# EAGLE design scanner-ale (EAGLE 6.6.0)
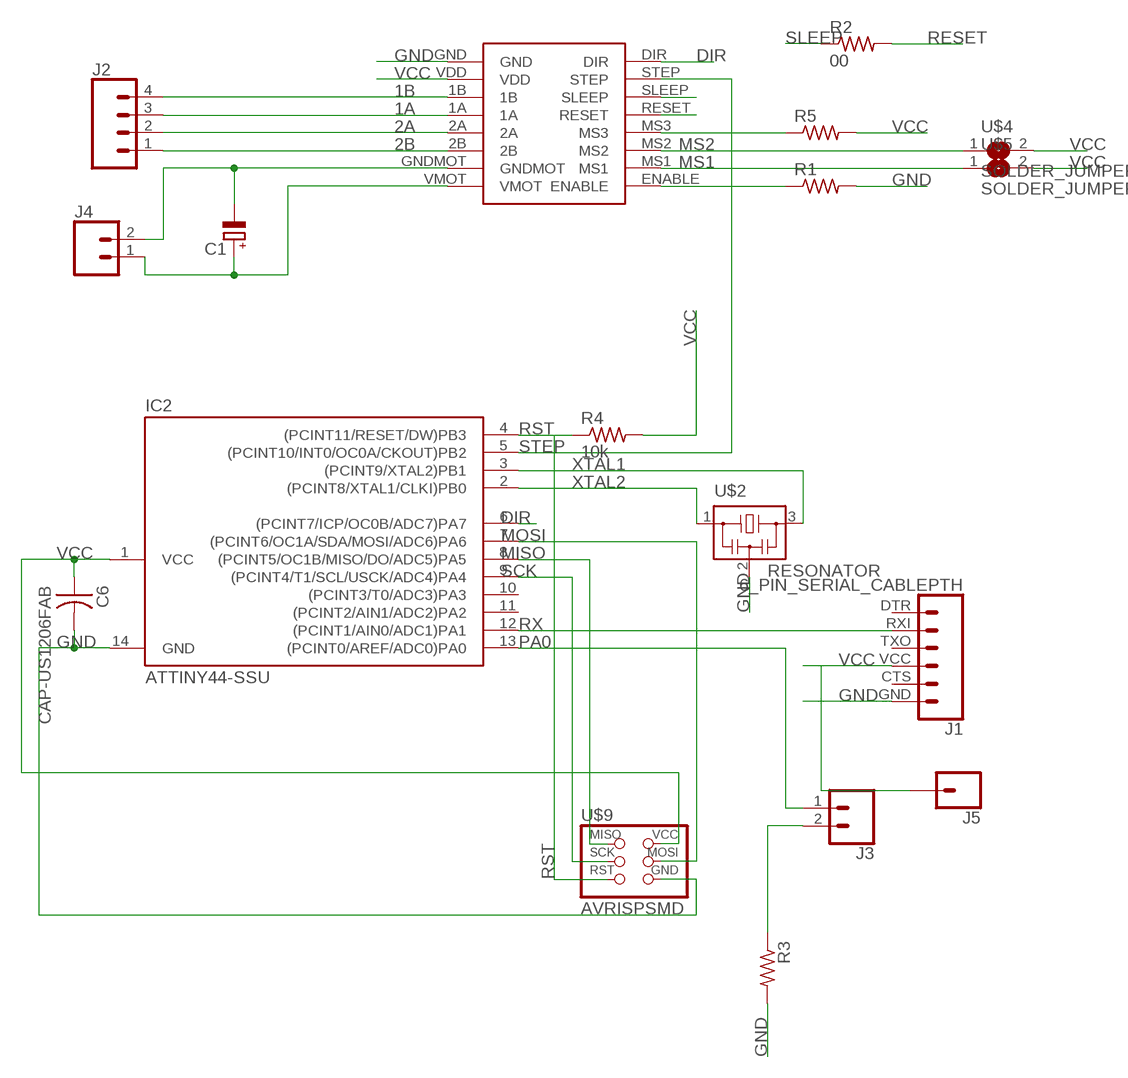
[diagram p0: schematic, sheet 1]

## Parts
C1  CPOL-EUE2,5-6E  [E2,5-6E]
C6  CAP-US1206FAB  [C1206FAB]
IC2  ATTINY44-SSU  [SOIC14]
J1  6_PIN_SERIAL_CABLEPTH  [FTDI_BASIC]
J2  CONN_04  [1X04]
J3  CONN_02  [1X02]
J4  CONN_02  [1X02]
J5  CONN_01  [1X01]
R1  RES-US1206FAB  [R1206FAB]
R2  00  RES-US1206FAB  [R1206FAB]
R3  RES-US1206FAB  [R1206FAB]
R4  10k  RES-US1206FAB  [R1206FAB]
R5  RES-US1206FAB  [R1206FAB]
U$1  POLOLUESTEPPERDRIVERDIL16MAT  [DIL16]
U$2  RESONATOR  [EFOBM]
U$4  SOLDER_JUMPER  [SJFAB]
U$5  SOLDER_JUMPER  [SJFAB]
U$9  AVRISPSMD  [2X03SMD]

## Nets
1A: J2.3 U$1.1A
1B: J2.4 U$1.1B
2A: J2.2 U$1.2A
2B: J2.1 U$1.2B
DIR: IC2.6((PCINT7/ICP/OC0B/ADC7)PA7) U$1.DIR
GND: C6.2 IC2.14(GND) J1.GND R1.2 R3.2 U$1.GND U$2.2 U$9.6(GND)
MISO: IC2.8((PCINT5/OC1B/MISO/DO/ADC5)PA5) U$9.1(MISO)
MOSI: IC2.7((PCINT6/OC1A/SDA/MOSI/ADC6)PA6) U$9.4(MOSI)
MS1: U$1.MS1 U$5.1
MS2: U$1.MS2 U$4.1
N$1: C1.- J4.2 U$1.GNDMOT
N$2: R1.1 U$1.ENABLE
N$3: C1.+ J4.1 U$1.VMOT
N$4: J3.2 R3.1
N$5: R5.1 U$1.MS3
PA0: IC2.13((PCINT0/AREF/ADC0)PA0) J3.1
RESET: R2.2 U$1.RESET
RST: IC2.4((PCINT11/RESET/DW)PB3) R4.1 U$9.5(RST)
RX: IC2.12((PCINT1/AIN0/ADC1)PA1) J1.RXI
SCK: IC2.9((PCINT4/T1/SCL/USCK/ADC4)PA4) U$9.3(SCK)
SLEEP: R2.1 U$1.SLEEP
STEP: IC2.5((PCINT10/INT0/OC0A/CKOUT)PB2) U$1.STEP
VCC: C6.1 IC2.1(VCC) J1.VCC J5.1 R4.2 R5.2 U$1.VDD U$4.2 U$5.2 U$9.2(VCC)
XTAL1: IC2.3((PCINT9/XTAL2)PB1) U$2.3
XTAL2: IC2.2((PCINT8/XTAL1/CLKI)PB0) U$2.1
Unconnected: IC2.10((PCINT3/T0/ADC3)PA3) IC2.11((PCINT2/AIN1/ADC2)PA2) J1.CTS J1.DTR J1.TXO

## Library data of the parts
C1 = rcl:CPOL-EU: POLARIZED CAPACITOR, European symbol
C6 = 01_fab:CAP-US
IC2 = 01_fab:ATTINY44
J1 = 01_SparkFun-Connectors:6_PIN_SERIAL_CABLE: 6-pin header connection for use with the "FTDI BASIC" pinout - CABLE SIDE. Also known as "Arduino Serial Program Header". This is used on a design to provide a 6-pin connection point for serial communication usually from a USB cable (D+/D-) to these headers (RX/TX). It also has the remaining pins necessary for programming in the Arduino evironment (DTR, GND, and sometimes VCC). Note, this device has "CABLE" in the name. It is intended to be used on a design that usually lives on the end of your USB cable and prvides the converter chip (FTDI232 or FTDI231x) to commnicate serial RX/TX. The "sister" device, named "TARGET" is inteneded to be used on a design that contains a target micro-controller that you wish to program. You can populate with some of these: Female Headers <https://www.sparkfun.com/products/115> (PRT-00115) For reference (or to suit your programming needs) check out these designs: SparkFun FTDI Basic Breakout - 5V <https://www.sparkfun.com/products/9716> (DEV-09716) SparkFun FTDI Basic Breakout - 3.3V <https://www.sparkfun.com/products/9873> (DEV-09873) SparkFun FTDI SmartBasic <https://www.sparkfun.com/products/12935> (DEV-12935) SparkFun Beefy 3 - FTDI Basic Breakout <https://www.sparkfun.com/products/13746> (DEV-13746)
J2 = 01_SparkFun-Connectors:CONN_04: Multi connection point. Often used as Generic Header-pin footprint for 0.1 inch spaced/style header connections On any of the 0.1 inch spaced packages, you can populate with these: Break Away Headers - Straight <https://www.sparkfun.com/products/116> (PRT-00116) Break Away Male Headers - Right Angle <https://www.sparkfun.com/products/553> (PRT-00553) Female Headers <https://www.sparkfun.com/products/115> (PRT-00115) Break Away Headers - Machine Pin <https://www.sparkfun.com/products/117> (PRT-00117) Break Away Female Headers - Swiss Machine Pin <https://www.sparkfun.com/products/743> (PRT-00743) For SCREWTERMINALS and SPRING TERMINALS visit here: Screw Terimnals on SparkFun.com <https://www.sparkfun.com/search/results?term=Screw+Terminals> (5mm/3.5mm/2.54mm spacing) This device is also useful as a general connection point to wire up your design to another part of your project. Our various solder wires solder well into these plated through hole pads. Hook-Up Wire - Assortment (Stranded, 22 AWG) <https://www.sparkfun.com/products/11375> (PRT-11375) Hook-Up Wire - Assortment (Solid Core, 22 AWG) <https://www.sparkfun.com/products/11367> (PRT-11367) View the entire wire category on our website here <https://www.sparkfun.com/categories/141> Special notes: Molex polarized connector foot print use with SKU : PRT-08231 with associated crimp pins and housings. 1MM SMD Version SKU: PRT-10208; PROD_ID: CONN-09696
J3 J4 = 01_SparkFun-Connectors:CONN_02: Multi connection point. Often used as Generic Header-pin footprint for 0.1 inch spaced/style header connections On any of the 0.1 inch spaced packages, you can populate with these: Break Away Headers - Straight <https://www.sparkfun.com/products/116> (PRT-00116) Break Away Male Headers - Right Angle <https://www.sparkfun.com/products/553> (PRT-00553) Female Headers <https://www.sparkfun.com/products/115> (PRT-00115) Break Away Headers - Machine Pin <https://www.sparkfun.com/products/117> (PRT-00117) Break Away Female Headers - Swiss Machine Pin <https://www.sparkfun.com/products/743> (PRT-00743) For SCREWTERMINALS and SPRING TERMINALS visit here: Screw Terimnals on SparkFun.com <https://www.sparkfun.com/search/results?term=Screw+Terminals> (5mm/3.5mm/2.54mm spacing) This device is also useful as a general connection point to wire up your design to another part of your project. Our various solder wires solder well into these plated through hole pads. Hook-Up Wire - Assortment (Stranded, 22 AWG) <https://www.sparkfun.com/products/11375> (PRT-11375) Hook-Up Wire - Assortment (Solid Core, 22 AWG) <https://www.sparkfun.com/products/11367> (PRT-11367) View the entire wire category on our website here <https://www.sparkfun.com/categories/141> Special notes: Molex polarized connector foot print use with: PRT-08233 with associated crimp pins and housings. 2.54_SCREWTERM for use with PRT-10571. 3.5mm Screw Terminal footprints for PRT-08084 5mm Screw Terminal footprints for use with PRT-08432
J5 = SparkFun-Connectors:CONN_01: Single connection point. Often used as Generic Header-pin footprint for 0.1 inch spaced/style header connections On any of the 0.1 inch spaced packages, you can populate with these: Break Away Headers - Straight <https://www.sparkfun.com/products/116> (PRT-00116) Break Away Male Headers - Right Angle <https://www.sparkfun.com/products/553> (PRT-00553) Female Headers <https://www.sparkfun.com/products/115> (PRT-00115) Break Away Headers - Machine Pin <https://www.sparkfun.com/products/117> (PRT-00117) Break Away Female Headers - Swiss Machine Pin <https://www.sparkfun.com/products/743> (PRT-00743) This device is also useful as a general connection point to wire up your design to another part of your project. Our various solder wires solder well into these plated through hole pads. Hook-Up Wire - Assortment (Stranded, 22 AWG) <https://www.sparkfun.com/products/11375> (PRT-11375) Hook-Up Wire - Assortment (Solid Core, 22 AWG) <https://www.sparkfun.com/products/11367> (PRT-11367) View the entire wire category on our website here <https://www.sparkfun.com/categories/141> Special notes: SMTSO-256-ET is a "flush mount" nut for a 4-40 screw. We mostly use this on specialty testbeds; it is a nice way to connect hardware to your PCB at an adjustable hieght. Also note, the SNAP packages are for using a snappable style connector. We sell a baggie of snaps and they are also used on two LilyPad designs: Snap Assortment - 30 pack (male and female) <https://www.sparkfun.com/products/11347> (DEV-11347) LilyPad Arduino SimpleSnap <https://www.sparkfun.com/products/10941> (DEV-10941) LilyPad SimpleSnap Protoboard <https://www.sparkfun.com/products/10940> (DEV-10940)
R1-R5 = 01_fab:RES-US: Resistor (US Symbol) Variants with postfix FAB are widened to allow the routing of internal traces
U$1 = 01_reprap:POLOLUESTEPPERDRIVER: Pololu stepper driver based on the A4983.
U$2 = 01_fab:RESONATOR
U$4 U$5 = 01_fab:SOLDER_JUMPER
U$9 = 01_fab:AVRISP

## Board
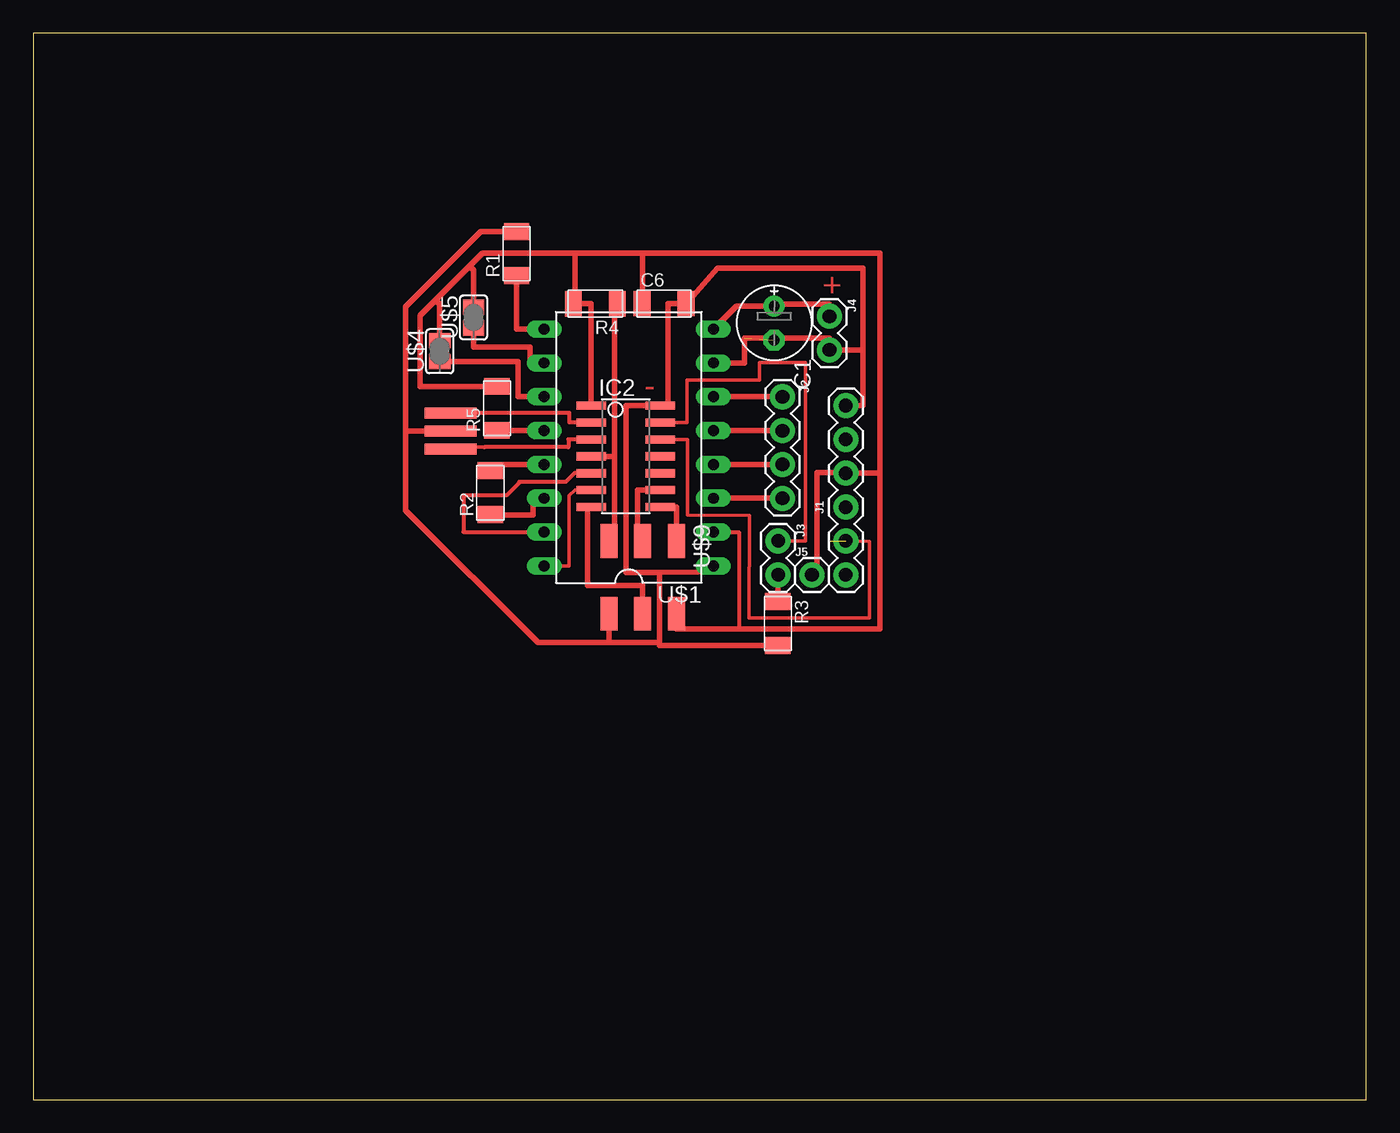
[diagram p1: board, top side]

Size 100 x 80 mm. Coordinates in mm from the lower left corner, seen from the top.
Outline: 0,0 100,0 100,80 0,80 0,0
Copper layers (1*16): Top 0.035mm / dielectric 1.5mm / Bottom 0.035mm
Design rules "default *": minimum track width 10mil, minimum drill 24mil, track to track 16mil, track to pad 16mil, pad to pad 16mil, via to via 16mil, smd to smd 16mil, copper to edge 40mil, drill to drill 8mil, minimum pad ring 10mil, minimum via ring 8mil, stop-mask expansion 4mil, vias tented up to drill 0mil, thermal gap 10mil

### Footprints (pad centres in the part's own frame; a part is rotated, then mirrored left to right if it is on the bottom)
E2,5-6E = drill 0.813 pad 1.575: + -1.27,0 | drill 0.813 pad 1.575 octagon: - 1.27,0
C1206FAB = smd 1.27 x 1.905: 1 -1.651,0; 2 1.651,0
SOIC14 = smd 0.61 x 2.21: 1 -3.81,-2.603; 2 -2.54,-2.603; 3 -1.27,-2.603; 4 0,-2.603; 5 1.27,-2.603; 6 2.54,-2.603; 7 3.81,-2.603; 8 3.81,2.603; 9 2.54,2.603; 10 1.27,2.603; 11 0,2.603; 12 -1.27,2.603; 13 -2.54,2.603; 14 -3.81,2.603
FTDI_BASIC = drill 1.016 pad 1.88: CTS 10.16,0; DTR 0,0; GND 12.7,0; RXI 2.54,0; TXO 5.08,0; VCC 7.62,0
1X04 = drill 1.016 pad 1.88: 1 0,0; 2 2.54,0; 3 5.08,0; 4 7.62,0
1X02 = drill 1.016 pad 1.88: 1 0,0; 2 2.54,0
1X01 = drill 1.016 pad 1.88: 1 0,0
R1206FAB = smd 1.27 x 1.905: 1 -1.651,0; 2 1.651,0
DIL16 = drill 0.813 long: 1A -17.78,1.27; 1B -17.78,3.81; 2A -17.78,-1.27; 2B -17.78,-3.81; DIR -5.08,8.89; ENABLE -5.08,-8.89; GND -17.78,8.89; GNDMOT -17.78,-6.35; MS1 -5.08,-6.35; MS2 -5.08,-3.81; MS3 -5.08,-1.27; RESET -5.08,1.27; SLEEP -5.08,3.81; STEP -5.08,6.35; VDD -17.78,6.35; VMOT -17.78,-8.89
EFOBM = smd 0.8 x 3.9: 1 -1.35,0; 2 0,0; 3 1.35,0
SJFAB = smd 1.118 x 1.6: 1 -0.787,0; 2 0.787,0
2X03SMD = smd 2.54 x 1.27: 1 -2.54,2.54; 2 2.92,2.54; 3 -2.54,0; 4 2.92,0; 5 -2.54,-2.54; 6 2.92,-2.54

### Placement (x,y rotation side)
C1  55.58,58.26 269.8 top
C6  47.32,59.72 0 top
IC2  44.45,48.26 270 top
J1  60.96,39.37 90 top
J2  56.21,52.73 270 top
J3  55.88,41.91 270 top
J4  59.73,58.77 270 top
J5  58.42,39.37 0 top
R1  36.25,63.46 90 top
R2  34.29,45.53 90 top
R3  55.86,35.71 270 top
R4  42.16,59.71 180 top
R5  34.79,51.86 90 top
U$1  33.25,48.92 180 top
U$2  31.31,50.16 270 top
U$4  30.49,56.14 90 top
U$5  33.03,58.68 90 top
U$9  45.72,39.37 270 top

### Tracks (layer width: path | path; a pad name or v marks a point on that pad's centre or on a via)
1A
  Top 0.406: U$1.1A J2.3
1B
  Top 0.406: U$1.1B J2.4
2A
  Top 0.406: U$1.2A J2.2
2B
  Top 0.406: U$1.2B J2.1
DIR
  Top 0.254: IC2.6 40.64,45.73 40.19,45.31 40.19,40.04 U$1.DIR
GND
  Top 0.406: 46.99,39.56 44.45,39.56 44.45,52.07 IC2.14 47.05,52.13 47.63,52.13 47.63,59.72 C6.2 48.97,59.69 51.33,62.37 51.33,62.39 62.23,62.39 62.23,52.07 J1.GND | 46.99,39.56 46.99,34.29 | 46.99,34.29 43.18,34.29 | 43.18,34.29 U$9.6 | U$2.2 27.94,50.16 | 27.94,50.16 27.94,44.21 37.86,34.29 43.18,34.29 | 46.97,34.28 46.99,34.29 | R3.2 46.99,34.06 46.99,34.29 | U$1.GND 49.84,39.57 46.99,39.56 | R1.2 33.56,65.11 27.94,59.5 27.94,50.16
MISO
  Top 0.406: IC2.8 48.26,44.45 U$9.1
MOSI
  Top 0.406: IC2.7 41.6,44.45 41.6,38.59 45.72,38.59 U$9.4
MS1
  Top 0.406: U$1.MS1 37.27,55.27 37.27,56.45 33.03,56.45 U$5.1
MS2
  Top 0.406: U$1.MS2 36.37,52.73 36.37,55.36 U$4.1
N$1  (1 unrouted)
  Top 0.406: 62.23,55.88 62.23,56.23 J4.2 59.73,57.15 53.34,57.15 53.34,55.27 U$1.GNDMOT
N$2
  Top 0.406: U$1.ENABLE 36.25,57.81 R1.1
N$3
  Top 0.406: U$1.VMOT 52.74,59.53 C1.+ 55.75,59.69 59.69,59.69 59.73,59.65 J4.1
N$4
  Top 0.406: R3.1 55.88,37.36 J3.2
N$5
  Top 0.406: U$1.MS3 34.79,50.2 R5.1
PA0
  Top 0.254: IC2.13 49.05,50.8 49.05,53.97 54.5,53.97 54.5,55.29 57.94,55.29 57.94,44.41 57.94,43.9 57.94,41.91 J3.1
RESET
  Top 0.406: U$1.RESET 34.29,47.66 R2.2
RST
  Top 0.406: U$9.5 43.59,41.91 43.59,48.26 | 43.59,48.26 43.59,54.13 | IC2.4 43.59,48.26 | 43.59,54.13 | 43.59,54.13 43.59,59.17 43.81,59.17 R4.1
RX  (1 unrouted)
  Top 0.254: IC2.12 49.08,49.53 49.09,43.84 53.72,43.82 53.69,36.15 62.72,36.15 62.74,41.89 J1.RXI
SCK
  Top 0.406: IC2.9 45.31,45.72 45.31,42.31 45.72,42.31 U$9.3
SLEEP
  Top 0.406: U$1.SLEEP 37.51,45.12 37.51,43.85 34.29,43.85 R2.1
STEP
  Top 0.305: IC2.5 40.59,46.99 39.94,46.34 36.47,46.34 36.41,46.23 36.4,46.23 35.5,45.33 32.28,45.33 32.28,42.59 38.33,42.59 U$1.STEP
VCC
  Top 0.305: U$1.VDD 52.94,42.58 52.94,35.32
  Top 0.406: IC2.1 41.85,59.71 R4.2 40.64,59.71 40.64,63.5 | 63.5,46.99 J1.VCC 60.96,47.03 58.79,47.03 58.79,39.37 J5.1 | 63.5,46.99 63.5,35.32 52.94,35.32 48.26,35.32 U$9.2 | 45.72,59.72 C6.1 45.72,59.77 45.72,63.5 | U$5.2 33.03,62.22 32.73,62.52 | 40.64,63.5 33.71,63.5 32.73,62.52 | U$4.2 30.48,59.69 30.19,59.98 | R5.2 29.03,53.51 29.03,58.82 30.19,59.98 | 32.73,62.52 30.19,59.98 | 40.64,63.5 45.72,63.5 | 45.72,63.5 63.5,63.5 63.5,46.99
XTAL1
  Top 0.305: IC2.3 40.15,49.53 40.15,48.94 33.85,48.94 U$2.3
XTAL2
  Top 0.305: IC2.2 40.22,50.8 40.22,51.52 33.85,51.52 U$2.1

### Text on the board
Top: + | -